# Altium schematic sheet RTC.SchDoc
size A4
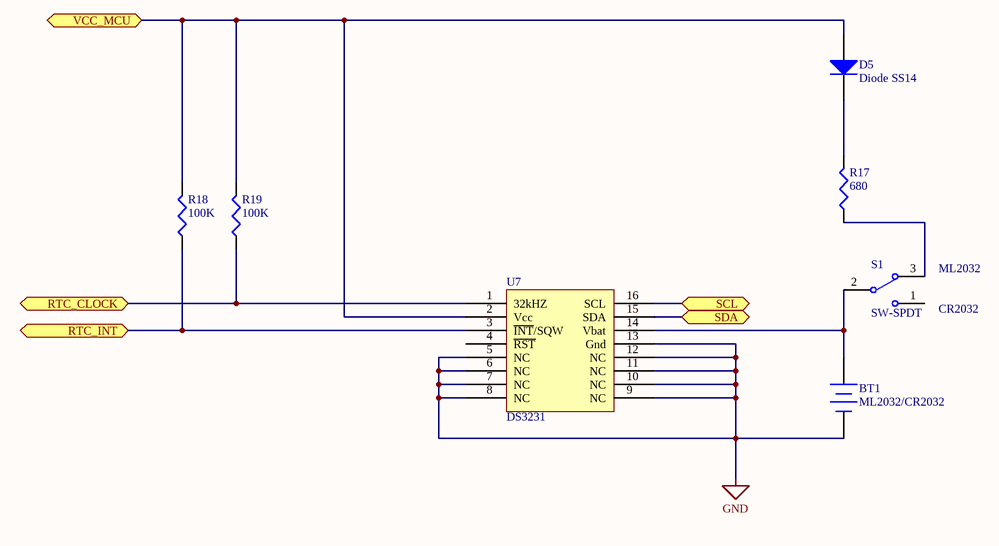
[diagram p0: RTC.SchDoc]

## Parts
BT1  ML2032/CR2032  [BAT2025-2032]
D5  Diode SS14  [SMA]
R17  value 680  [0603]  (hidden comment: Res3)
R18  value 100K  [0603]  (hidden comment: Res3)
R19  value 100K  [0603]  (hidden comment: Res3)
S1  SW-SPDT  [SW-SPDT]
U7  DS3231  [WSO16_M]

## Ports
RTC_CLOCK (bidir), RTC_INT (bidir), SCL (bidir), SDA (bidir), VCC_MCU (bidir)

## Nets
GND: BT1.2(-) U7.5(NC) U7.6(NC) U7.7(NC) U7.8(NC) U7.9(NC) U7.10(NC) U7.11(NC) U7.12(NC) U7.13(Gnd)
RTC_CLOCK: R19.1 U7.1(32kHZ) ; port RTC_CLOCK
RTC_INT: R18.1 U7.3(~{INT}/SQW) ; port RTC_INT
SCL: U7.16(SCL) ; port SCL
SDA: U7.15(SDA) ; port SDA
VCC_MCU: D5.1(A) R18.2 R19.2 U7.2(Vcc) ; port VCC_MCU
NetBT1_1: BT1.1(+) S1.2 U7.14(Vbat)
NetD5_2: D5.2(K) R17.2
NetR17_1: R17.1 S1.3

Not connected (* = marked no-connect by the designer): S1 1; U7 4(~{RST})

## Notes on the sheet
- (near S1) ML2032
- (near S1) CR2032

## Library data of the parts
BT1 = Battery: Multicell Battery; Published: 24-Mar-1999; LatestRevisionDate: 17-Jul-2002; LatestRevisionNote: Re-released for DXP Platform.; PackageReference: BAT-2; Publisher: Altium Limited; PackageDescription: Battery; 2 Leads
D5 = Diode 1N4005: 1 Amp General Purpose Rectifier; Published: 8-Jun-2000; LatestRevisionDate: 17-Jul-2002; LatestRevisionNote: Re-released for DXP Platform.; DatasheetVersion: 1998; PackageVersion: Aug-1999; PackageReference: DO-41; Publisher: Altium Limited; PackageDescription: Diode, Axial; Body 5.2 x 2.7 mm (LxDia. max), Lead Dia. 0.86 mm (max); Code_JEDEC: DO-204-AL; ComponentLink1Description: Manufacturer Link; ComponentLink1URL: http://www.fairchildsemi.com/; ComponentLink2Description: Datasheet; ComponentLink2URL: http://www.fairchildsemi.com/ds/1N%2F1N4001.pdf
R17-R19 = Res3: Resistor; Published: 8-Jun-2000; LatestRevisionDate: 29-May-2009; LatestRevisionNote: IPC-7351 Footprint Added.; PackageReference: J1-0603; Publisher: Altium Limited; PackageDescription: Chip Resistor
S1 = SW-SPDT: SPDT Subminiature Toggle Switch, Right Angle Mounting, Vertical Actuation; Published: 24-Mar-1999; LatestRevisionDate: 17-Dec-2003; LatestRevisionNote: Schematic revised, PCB Footprint replaced.; DatasheetVersion: 05-Dec-2000; PackageReference: TL36WW15050; Publisher: Altium Limited; PackageDescription: Switch; 4 Leads; ComponentLink1Description: Manufacturer Link; ComponentLink1URL: http://www.apem.com